# EAGLE design IN-12Relay (EAGLE 9.5.2)
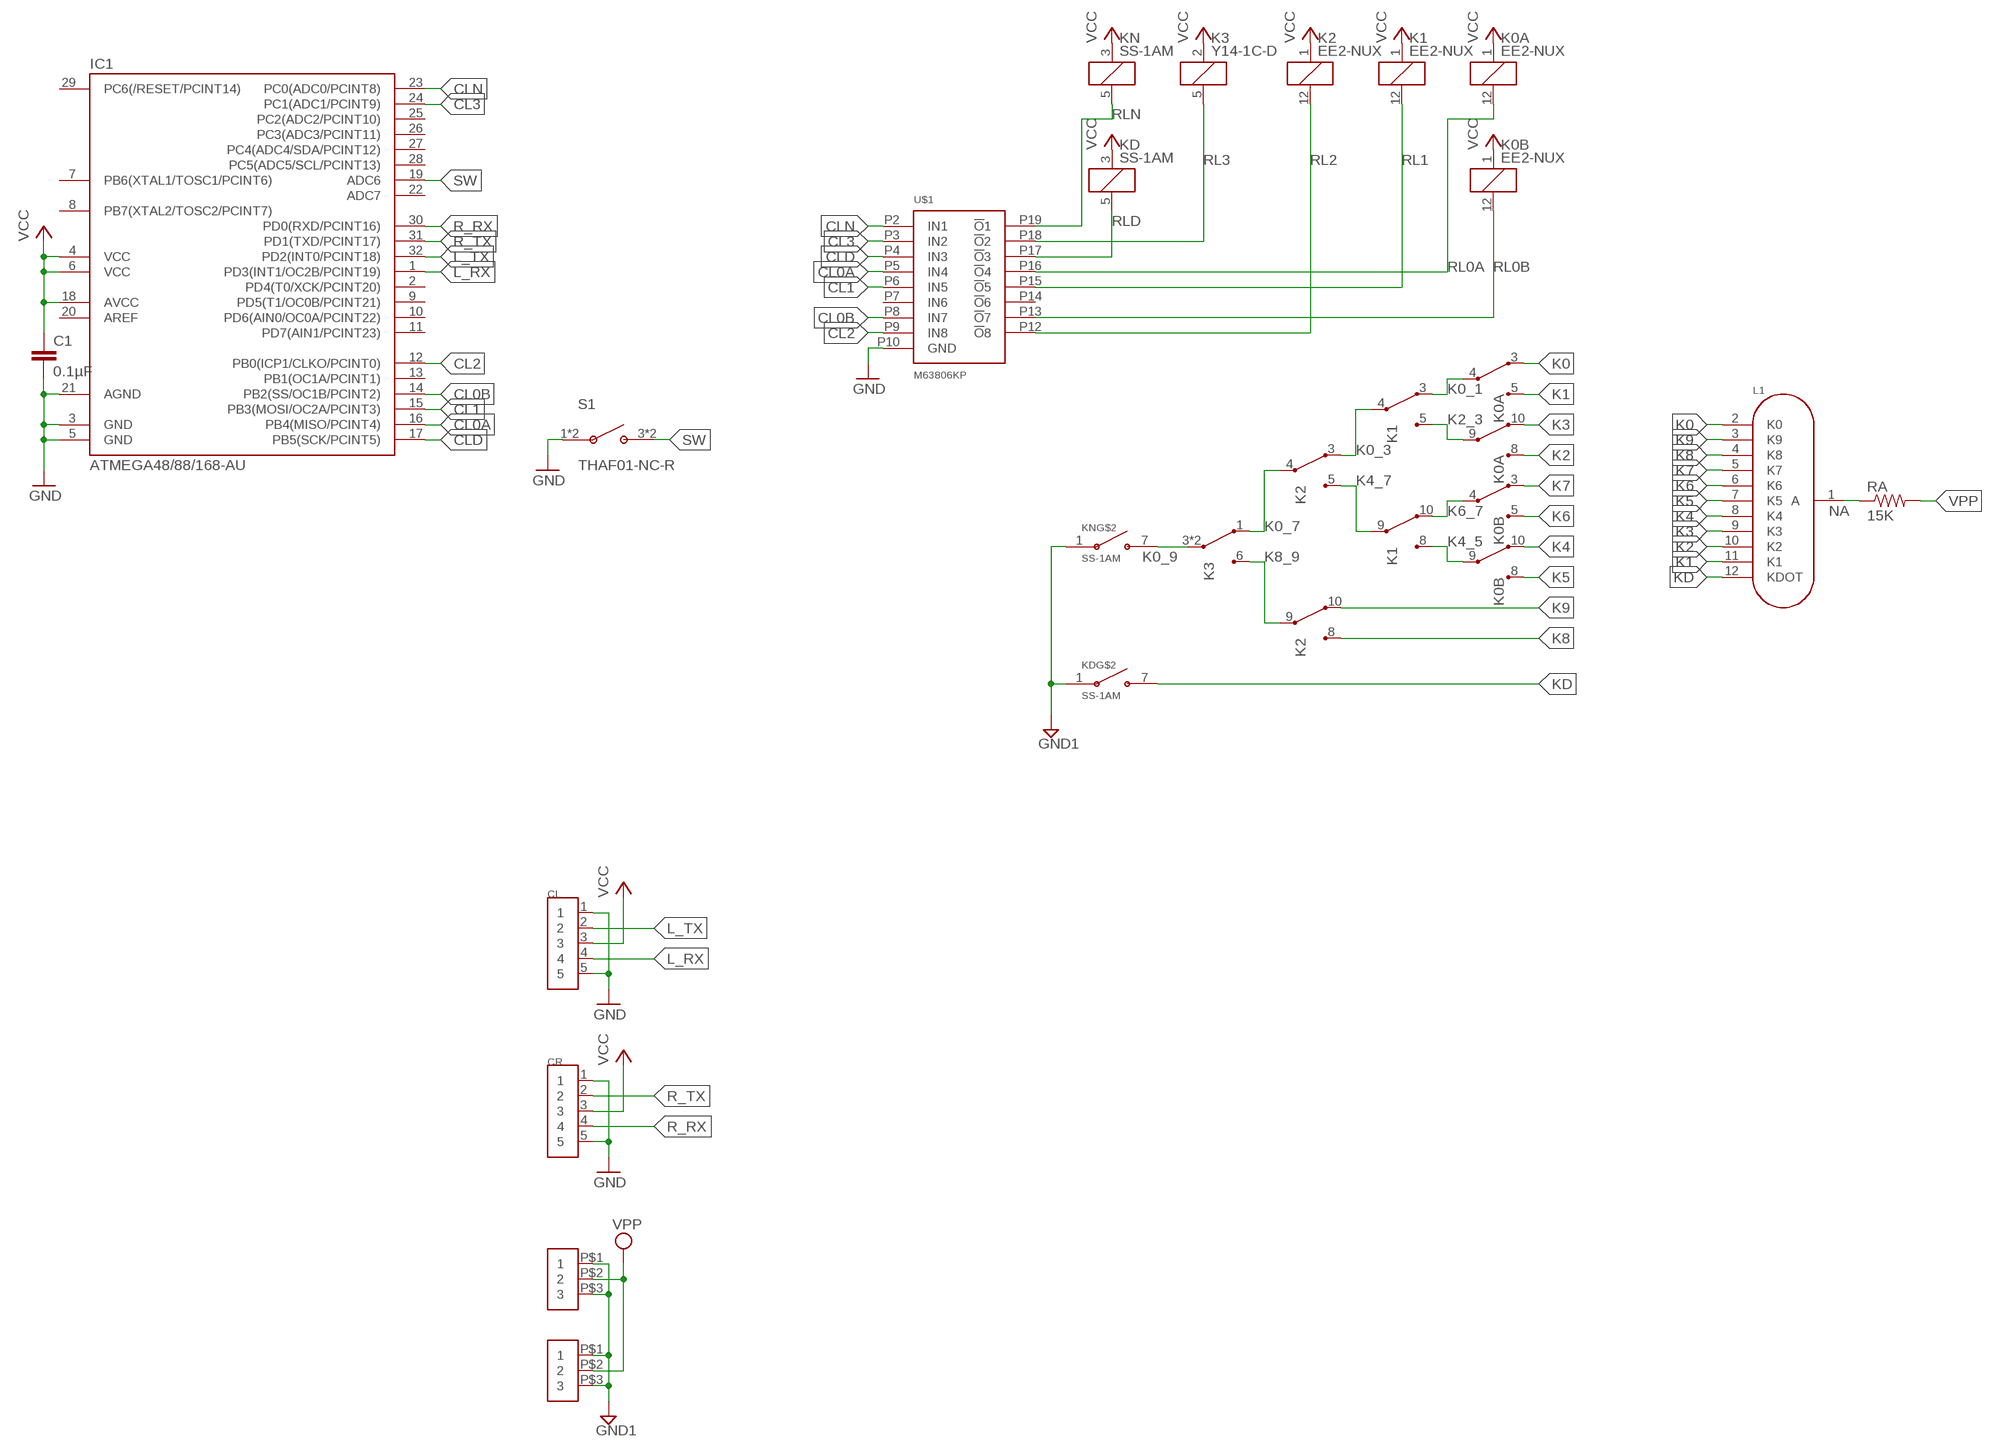
[diagram p0: schematic, sheet 1]

## Parts
C1  0.1µF  C-EUC0603K  [C0603K]
CL  P5  [P5_2.54]
CR  P5  [P5_2.54]
IC1  ATMEGA48/88/168-AU  [TQFP32-08]
K0A  EE2-NUX  [EE2-*NUX]
K0B  EE2-NUX  [EE2-*NUX]
K1  EE2-NUX  [EE2-*NUX]
K2  EE2-NUX  [EE2-*NUX]
K3  Y14-1C-D  [Y14*-1C-*D*]
KD  SS-1AM  [SS-1****M]
KN  SS-1AM  [SS-1****M]
L1  IN-12B_PS  [IN-12_PS]
PL  P3  [P3_2.54]
PR  P3  [P3_2.54]
RA  15K  R-US_R1206  [R1206]
S1  THAF01-NC-R  [THAF01-NC-R]
U$1  M63806KP  [20P2E]

## Nets
CL0A: IC1.16(PB4(MISO/PCINT4)) U$1.P5(IN4)
CL0B: IC1.14(PB2(SS/OC1B/PCINT2)) U$1.P8(IN7)
CL1: IC1.15(PB3(MOSI/OC2A/PCINT3)) U$1.P6(IN5)
CL2: IC1.12(PB0(ICP1/CLKO/PCINT0)) U$1.P9(IN8)
CL3: IC1.24(PC1(ADC1/PCINT9)) U$1.P3(IN2)
CLD: IC1.17(PB5(SCK/PCINT5)) U$1.P4(IN3)
CLN: IC1.23(PC0(ADC0/PCINT8)) U$1.P2(IN1)
GND: C1.2 CL.1 CL.5 CR.1 CR.5 IC1.3(GND) IC1.5(GND) IC1.21(AGND) S1.1(A) S1.2(A) U$1.P10(GND)
GND1: KD.1 KN.1 PL.P$1 PL.P$3 PR.P$1 PR.P$3
K0: K0A.3(S) L1.2(K0)
K0_1: K0A.4(P) K1.3(S)
K0_3: K1.4(P) K2.3(S)
K0_7: K2.4(P) K3.1(S)
K0_9: K3.3(P) K3.4(P) KN.7
K1: K0A.5(O) L1.11(K1)
K2: K0A.8(O) L1.10(K2)
K2_3: K0A.9(P) K1.5(O)
K3: K0A.10(S) L1.9(K3)
K4: K0B.10(S) L1.8(K4)
K4_5: K0B.9(P) K1.8(O)
K4_7: K1.9(P) K2.5(O)
K5: K0B.8(O) L1.7(K5)
K6: K0B.5(O) L1.6(K6)
K6_7: K0B.4(P) K1.10(S)
K7: K0B.3(S) L1.5(K7)
K8: K2.8(O) L1.4(K8)
K8_9: K2.9(P) K3.6(O)
K9: K2.10(S) L1.3(K9)
KD: KD.7 L1.12(KDOT)
L_RX: CL.4 IC1.1(PD3(INT1/OC2B/PCINT19))
L_TX: CL.2 IC1.32(PD2(INT0/PCINT18))
NA: L1.1(A) RA.1
R_RX: CR.4 IC1.30(PD0(RXD/PCINT16))
R_TX: CR.2 IC1.31(PD1(TXD/PCINT17))
RL0A: K0A.12 U$1.P16(!O!4)
RL0B: K0B.12 U$1.P13(!O!7)
RL1: K1.12 U$1.P15(!O!5)
RL2: K2.12 U$1.P12(!O!8)
RL3: K3.5 U$1.P18(!O!2)
RLD: KD.5 U$1.P17(!O!3)
RLN: KN.5 U$1.P19(!O!1)
SW: IC1.19(ADC6) S1.3(B) S1.4(B)
VCC: C1.1 CL.3 CR.3 IC1.4(VCC) IC1.6(VCC) IC1.18(AVCC) K0A.1 K0B.1 K1.1 K2.1 K3.2 KD.3 KN.3
VPP: PL.P$2 PR.P$2 RA.2
Unconnected: IC1.2(PD4(T0/XCK/PCINT20)) IC1.7(PB6(XTAL1/TOSC1/PCINT6)) IC1.8(PB7(XTAL2/TOSC2/PCINT7)) IC1.9(PD5(T1/OC0B/PCINT21)) IC1.10(PD6(AIN0/OC0A/PCINT22)) IC1.11(PD7(AIN1/PCINT23)) IC1.13(PB1(OC1A/PCINT1)) IC1.20(AREF) IC1.22(ADC7) IC1.25(PC2(ADC2/PCINT10)) IC1.26(PC3(ADC3/PCINT11)) IC1.27(PC4(ADC4/SDA/PCINT12)) IC1.28(PC5(ADC5/SCL/PCINT13)) IC1.29(PC6(/RESET/PCINT14)) U$1.P7(IN6) U$1.P14(!O!6)

## Library data of the parts
C1 = rcl:C-EU: CAPACITOR, European symbol; SPICEPREFIX: C
CL CR = pins:P5
IC1 = atmega8:ATMEGA48/88/168
K0A K0B K1 K2 = relays:EE2-*NUX
K3 = relays:Y14*-1C-*D*
KD KN = relays:SS-1A**M
L1 = nixie-tube:IN-12B_PS
PL PR = pins:P3
RA = rcl:R-US_: RESISTOR, American symbol; SPICEPREFIX: R
S1 = switches:THAF01-NC-R
U$1 = transistor-arrays:M63806KP

## Board
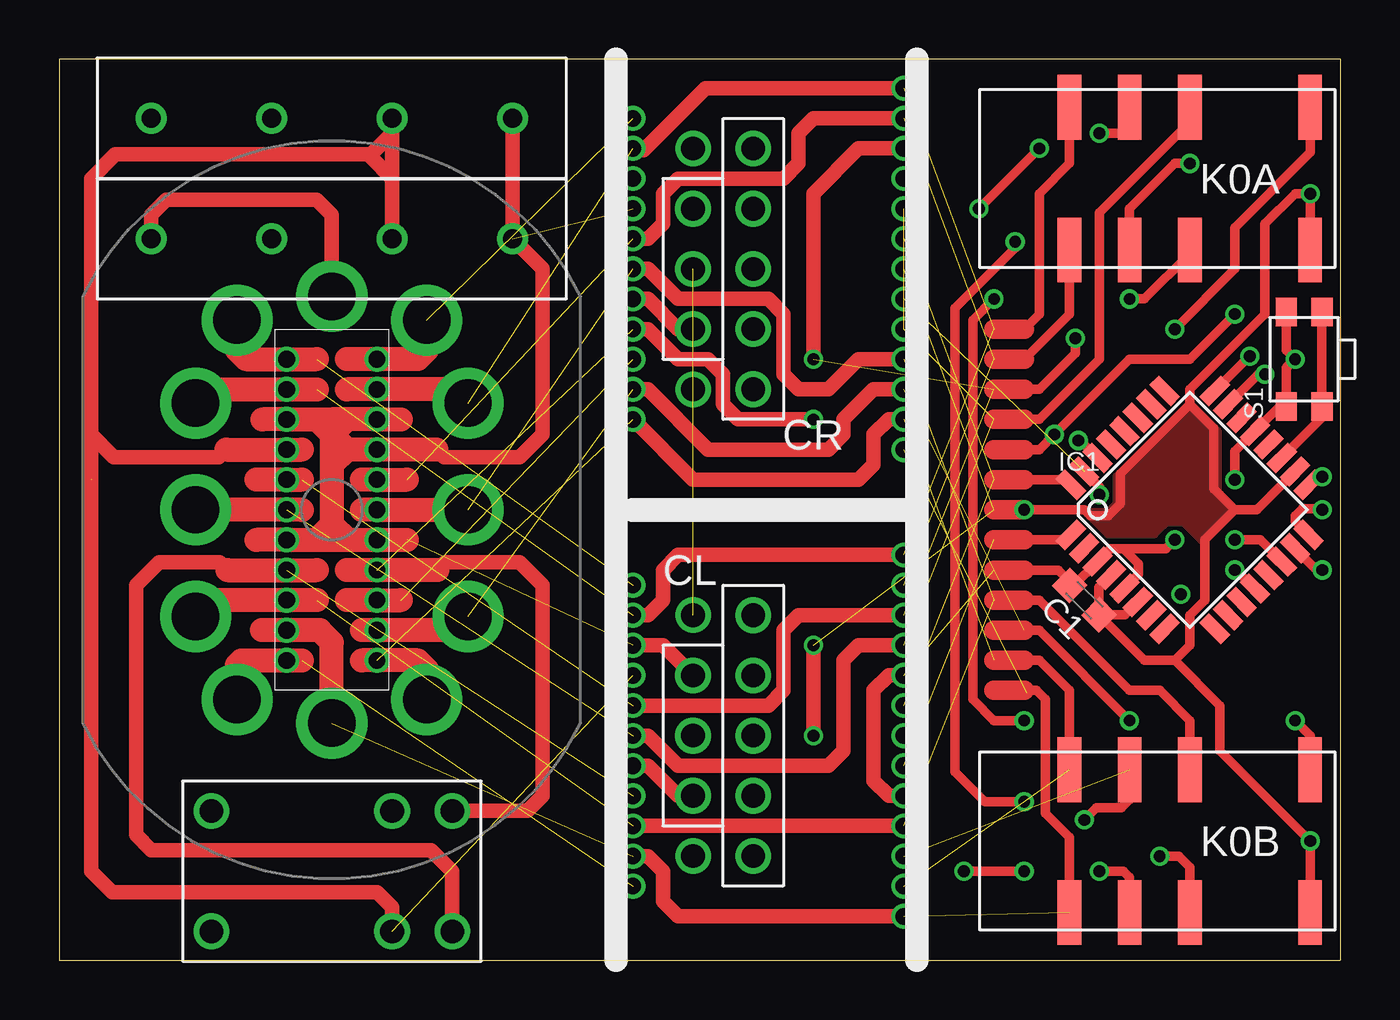
[diagram p1: board, top side]
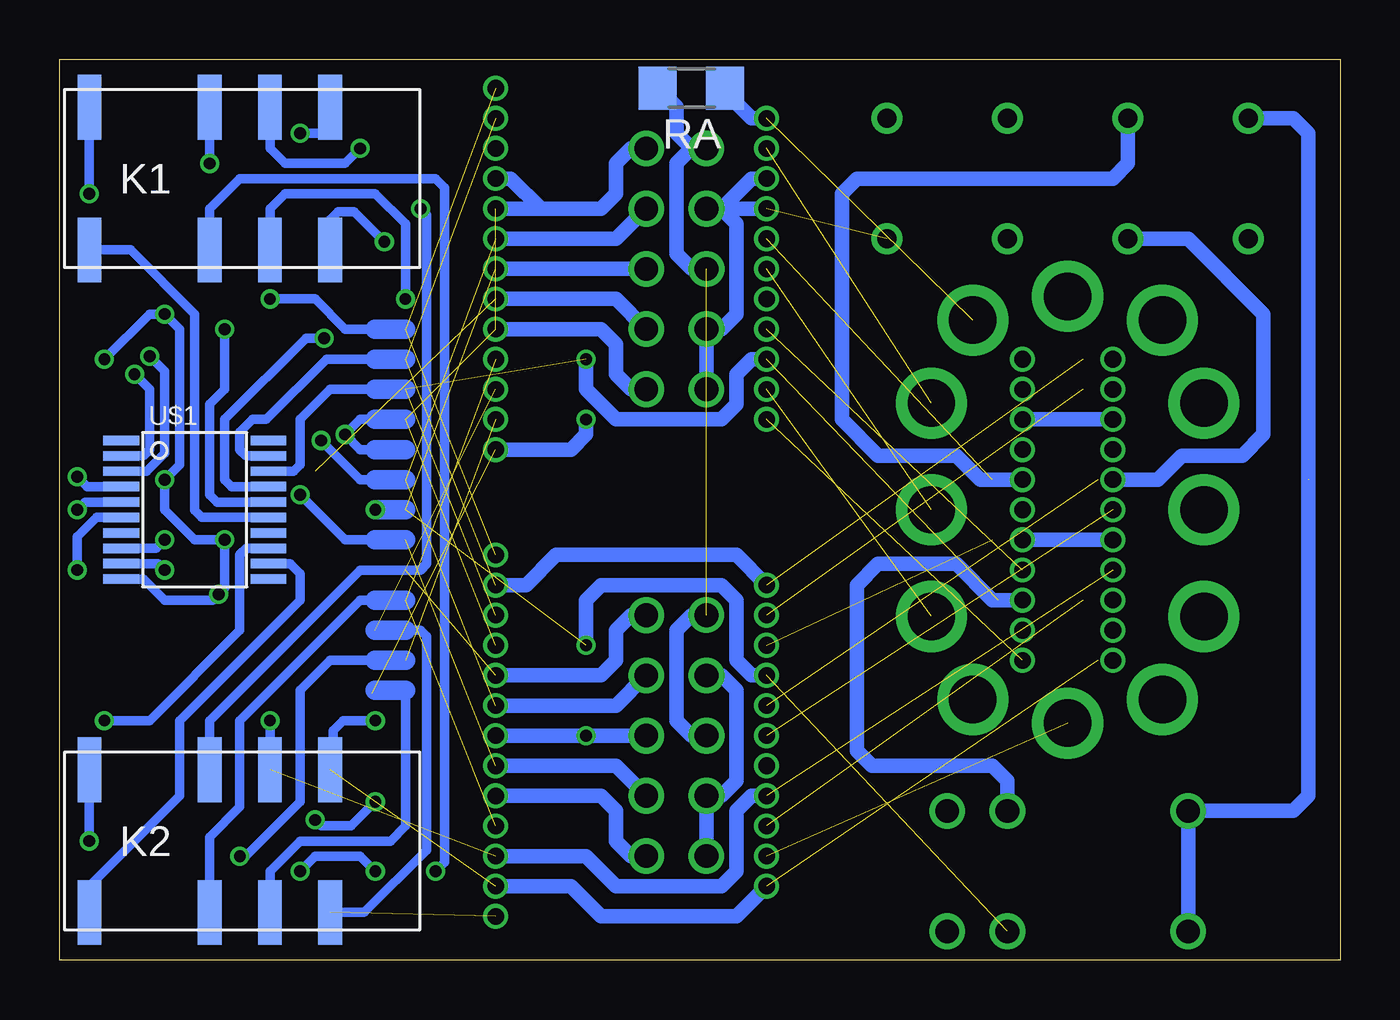
[diagram p2: board, bottom side, seen from below]

Size 54.05 x 38 mm. Coordinates in mm from the lower left corner, seen from the top.
Outline: 0,0 54.05,0 54.05,38 0,38 0,0
Copper layers (1*16): Top 0.035mm / dielectric 1.5mm / Bottom 0.035mm
Design rules "SeeedStudio_2layer_DRU_no_angle_20140221": minimum track width 6mil, minimum drill 12mil, track to track 6mil, track to pad 6mil, pad to pad 6mil, via to via 6mil, smd to smd 0mil, copper to edge 10mil, drill to drill 10mil, minimum pad ring 10mil, minimum via ring 6mil, stop-mask expansion 2mil, vias tented up to drill 100mil, thermal gap 10mil

### Footprints (pad centres in the part's own frame; a part is rotated, then mirrored left to right if it is on the bottom)
C0603K = smd 1.05 x 1.08: 1 -0.875,0; 2 0.875,0
P5_2.54 = drill 1: 1 0,5.08; 2 0,2.54; 3 0,0; 4 0,-2.54; 5 0,-5.08
TQFP32-08 = smd 1.27 x 0.559: 1 -4.293,2.8; 2 -4.293,2; 3 -4.293,1.2; 4 -4.293,0.4; 5 -4.293,-0.4; 6 -4.293,-1.2; 7 -4.293,-2; 8 -4.293,-2.8; 17 4.293,-2.8; 18 4.293,-2; 19 4.293,-1.2; 20 4.293,-0.4; 21 4.293,0.4; 22 4.293,1.2; 23 4.293,2; 24 4.293,2.8 | smd 0.559 x 1.27: 9 -2.8,-4.293; 10 -2,-4.293; 11 -1.2,-4.293; 12 -0.4,-4.293; 13 0.4,-4.293; 14 1.2,-4.293; 15 2,-4.293; 16 2.8,-4.293; 25 2.8,4.293; 26 2,4.293; 27 1.2,4.293; 28 0.4,4.293; 29 -0.4,4.293; 30 -1.2,4.293; 31 -2,4.293; 32 -2.8,4.293
EE2-*NUX = smd 1 x 2.73: 1 -6.35,3.01; 3 -1.27,3.01; 4 1.27,3.01; 5 3.81,3.01; 8 3.81,-3.01; 9 1.27,-3.01; 10 -1.27,-3.01; 12 -6.35,-3.01
Y14*-1C-*D* = drill 1: 1 -5.08,2.54; 2 -2.54,2.54; 3 5.08,2.54; 4 5.08,-2.54; 5 -2.54,-2.54; 6 -5.08,-2.54
SS-1****M = drill 0.8: 1 -7.62,0; 3 -2.54,0; 5 2.54,0; 7 7.62,0
IN-12_PS = drill 2: 1 4,8; 2 5.75,4.5; 3 5.75,0; 4 5.75,-4.5; 5 4,-8; 6 0,-9; 7 -4,-8; 8 -5.75,-4.5; 9 -5.75,0; 10 -5.75,4.5; 11 -4,8; 12 0,9
P3_2.54 = drill 1: P$1 0,2.54; P$2 0,0; P$3 0,-2.54
R1206 = smd 1.6 x 1.803: 1 -1.422,0; 2 1.422,0
THAF01-NC-R = smd 1.2 x 0.9: 1 -2,0.75; 2 2,0.75; 3 -2,-0.75; 4 2,-0.75
20P2E = smd 1.5 x 0.4: P1 -3.1,2.925; P2 -3.1,2.275; P3 -3.1,1.625; P4 -3.1,0.975; P5 -3.1,0.325; P6 -3.1,-0.325; P7 -3.1,-0.975; P8 -3.1,-1.625; P9 -3.1,-2.275; P10 -3.1,-2.925; P11 3.1,-2.925; P12 3.1,-2.275; P13 3.1,-1.625; P14 3.1,-0.975; P15 3.1,-0.325; P16 3.1,0.325; P17 3.1,0.975; P18 3.1,1.625; P19 3.1,2.275; P20 3.1,2.925

### Placement (x,y rotation side)
C1  43.25,15.19 135 top
CL  29.28,9.47 0 top
CR  29.28,29.16 180 top
IC1  47.7,19 45 top
K0A  46.42,32.97 180 top
K0B  46.42,5.03 180 top
K1  46.42,32.97 0 bottom
K2  46.42,5.03 0 bottom
K3  Y14-1C-*D*  [Y14*-1C-*D*]  11.5,3.76 180 top
KD  SS-1A*M  [SS-1****M]  11.5,30.43 180 top
KN  SS-1A*M  [SS-1****M]  11.5,35.51 180 top
L1  11.5,19 0 top
PL  26.74,29.16 0 top
PR  26.74,9.47 0 top
RA  27.38,36.78 180 bottom
S1  52.52,25.35 90 top
U$1  48.33,19 0 bottom

### Tracks (layer width: path | path; a pad name or v marks a point on that pad's centre or on a via)
CL0A  (via drill 0.5)
  Top 0.406: IC1.16 52.14,18.52 52.14,18.75 52.45,19.05 53.23,19.05 v53.28,19
  Bottom 0.406: U$1.P5 52.96,19.32 v53.28,19
CL0B  (via drill 0.5)
  Top 0.406: IC1.14 50.66,17.73 v49.6,17.73
  Bottom 0.406: U$1.P8 49.95,17.38 v49.6,17.73
CL1  (via drill 0.5)
  Top 0.406: IC1.15 53.06,16.46 v53.28,16.46
  Bottom 0.406: U$1.P6 52.47,18.68 53.28,17.86 v53.28,16.46
CL2  (via drill 0.5)
  Top 0.406: v49.6,16.46 49.67,16.46 IC1.12
  Bottom 0.406: U$1.P9 49.87,16.73 v49.6,16.46
CL3  (via drill 0.5)
  Top 0.406: IC1.24 50.21,25.48 v50.23,25.48
  Bottom 0.406: U$1.P3 50.36,20.62 49.6,21.38 49.6,24.84 v50.23,25.48
CLD  (via drill 0.5)
  Top 0.406: IC1.17 53.05,20.4 v53.28,20.4
  Bottom 0.406: v53.28,20.4 52.86,19.98 U$1.P4
CLN  (via drill 0.5)
  Top 0.406: v50.87,24.71 50.58,24.71 IC1.23
  Bottom 0.406: U$1.P2 50.5,21.27 50.23,21.54 50.23,24.08 v50.87,24.71
GND  (via drill 0.5, 0.7)  (3 unrouted)
  Top 0.406: 40.71,21.54 41.34,21.54 v41.98,22.18 45.16,25.35 47.7,25.35 v49.6,27.26 | 51.68,27.26 S1.2 51.77,25.72 v52.14,25.35 51.77,24.98 S1.1 51.48,23.35 IC1.21 49.6,21.47 v49.6,20.27 | 42.81,15.81 IC1.3 44.35,17.35 44.9,17.35 | 42.81,15.81 C1.2 | 40.71,16.46 42.16,16.46 42.81,15.81 | 44.9,17.35 45.54,16.71 45.54,16.27 IC1.5 | 44.9,17.35 46.68,17.35 v47.06,17.73
  Top 0.61: v35.63,6.94 35,6.94 34.36,7.57 34.36,11.38 35,12.02 v35.63,12.02
  Top 0.813: 39.44,16.46 40.71,16.46 | 39.44,21.54 40.71,21.54
  Bottom 0.406: 40.71,21.54 41.34,21.54 v41.98,22.18 41.34,22.81 40.71,22.81 | U$1.P10 50.48,16.07 49.6,15.19 47.57,15.19 v47.31,15.44 47.06,15.7 v47.06,17.73 48.33,17.73 49.6,19 v49.6,20.27 48.97,20.91 48.97,26.62 v49.6,27.26 50.23,27.26 v52.14,25.35
  Bottom 0.61: v35.63,12.02 31.18,12.02 30.55,12.65 30.55,13.92 29.91,14.55 CL.1 | CL.5 29.91,4.39 30.55,5.03 30.55,6.3 31.18,6.94 v35.63,6.94 | 33.73,31.7 31.18,31.7 30.55,32.34 30.55,33.61 29.91,34.24 CR.5 | 33.73,31.7 v35.63,31.7 | v35.63,26.62 31.18,26.62 30.55,25.98 30.55,24.71 29.91,24.08 CR.1 | v35.63,32.97 35,32.97 33.73,31.7
  Bottom 0.813: 40.71,21.54 39.44,21.54 | 40.71,22.81 39.44,22.81
GND1  (via drill 0.7, 1)  (2 unrouted)
  Top 0.61: 15.9,21.54 16.23,21.21 19.43,21.21 20.39,22.18 20.39,29.16 KD.1 KN.1 | v24.2,13.29 25.47,13.29 PR.P$1 | v24.2,8.21 24.84,8.21 26.11,6.94 PR.P$3 | v24.2,27.89 24.84,27.89 26.11,26.62 PL.P$3
  Top 1.016: 15.9,21.54 v13.4,21.54 12.13,21.54 | 10.87,17.73 v9.6,17.73 8.32,17.73 | 10.87,17.73 11.5,17.73 | 11.5,17.73 12.13,17.73 | 12.13,17.73 v13.4,17.73 14.68,17.73 | 10.87,22.81 v9.6,22.81 8.58,22.81 | 10.87,22.81 11.5,22.81 | 12.13,22.81 v13.4,22.81 14.42,22.81 | 12.13,22.81 11.5,22.81 | 11.5,21.54 11.5,20.91 | 11.5,20.91 11.5,18.36 | 11.5,18.36 11.5,17.73 | 12.13,21.54 11.5,21.54 | 10.87,17.73 11.5,18.36 | 11.5,18.36 12.13,17.73 | 11.5,22.81 11.5,22.18 | 11.5,22.18 11.5,21.54 | 10.87,22.81 11.5,22.18 | 12.13,21.54 11.5,22.18 | 11.5,22.18 12.13,22.81 | 11.5,20.91 12.13,21.54
  Bottom 0.61: PR.P$1 26.11,12.02 25.47,11.38 25.47,7.57 26.11,6.94 PR.P$3 v26.74,4.39 | v26.74,24.08 PL.P$3 26.11,26.62 25.47,27.26 25.47,31.06 26.11,31.7 | 26.11,31.7 PL.P$1 | v24.2,31.7 26.11,31.7 | v24.2,32.97 24.84,32.97 26.11,31.7 | v9.6,17.73 v13.4,17.73 | v9.6,22.81 v13.4,22.81
K0  (via drill 0.5, 0.7)  (2 unrouted)
  Top 0.406: 47.7,29.8 45.79,27.89 v45.16,27.89
  Top 0.61: v24.2,34.24 24.27,34.17 24.65,34.17 27.26,36.78 v35.63,36.78
  Top 0.813: K0A.3 47.7,29.8
  Top 1.016: L1.2 17.16,23.5 16.58,24.08 v13.4,24.08 12.13,24.08
  Bottom 0.406: v45.16,27.89 43.25,27.89 41.98,26.62 40.71,26.62
  Bottom 0.813: 40.71,26.62 39.44,26.62
K0_1  (via drill 0.5)
  Top 0.406: v47.7,33.61 47.06,33.61 45.16,31.7 K0A.4
  Bottom 0.406: K1.3 v47.7,33.61
K0_3  (via drill 0.5)
  Top 0.406: v38.8,31.7 v41.34,34.24
  Bottom 0.406: K1.4 45.16,34.24 44.52,33.61 41.98,33.61 v41.34,34.24 | K2.3 47.7,10.11 41.34,16.46 38.8,16.46 38.55,16.71 38.55,31.45 v38.8,31.7
  Bottom 0.813: K2.3 47.7,7.66
K0_7  (via drill 0.5, 0.7)  (2 unrouted)
  Top 0.406: 40.71,13.92 41.34,13.92 v45.16,10.11
  Top 0.61: K3.1 16.58,3.76 15.69,4.65 3.88,4.65 3.24,5.28 3.24,15.82 4.21,16.79 6.77,16.79 7.1,16.46
  Top 0.813: 40.71,13.92 39.44,13.92
  Top 1.016: 7.1,16.46 v9.6,16.46 10.87,16.46
  Bottom 0.406: K2.4 v45.16,10.11
  Bottom 0.61: v24.2,6.94 24.84,6.94 25.47,6.3 25.47,3.76 26.11,3.12 30.55,3.12 31.82,4.39 v35.63,4.39
K0_9
  Bottom 0.61: KN.7 1.97,35.51 1.34,34.88 1.34,6.94 1.97,6.3 K3.4 K3.3
K1  (via drill 0.7)  (2 unrouted)
  Top 0.406: K0A.5 42.61,27.26 40.71,25.35
  Top 0.813: 40.71,25.35 39.44,25.35
  Top 1.016: L1.11 7.5,25.73 7.88,25.35 v9.6,25.35 10.87,25.35
  Bottom 0.61: v24.2,15.82 25.47,17.09 33.09,17.09 34.36,15.82 v35.63,15.82
K2  (via drill 0.7)  (2 unrouted)
  Top 0.406: K0A.8 42.61,33.61 41.34,32.34 41.34,27.26 40.71,26.62
  Top 0.61: v24.2,14.55 24.84,14.55 25.47,15.19 25.47,16.46 26.11,17.09 v35.63,17.09
  Top 0.813: 40.71,26.62 39.44,26.62
  Top 1.016: L1.10 5.84,23.5 6.42,24.08 v9.6,24.08 10.87,24.08
K2_3  (via drill 0.5)
  Top 0.406: v43.88,34.88 45.16,34.88 K0A.9
  Bottom 0.406: K1.5 42.61,34.88 v43.88,34.88
K3  (via drill 0.7)  (2 unrouted)
  Top 0.406: 47.7,35.34 43.88,31.54 43.88,25.35 41.34,22.81 40.71,22.81
  Top 0.61: v35.63,13.29 33.73,13.29 33.09,12.65 33.09,8.84 32.45,8.21 26.11,8.21 24.84,9.47 v24.2,9.47
  Top 0.813: K0A.10 47.7,35.34 | 40.71,22.81 39.44,22.81
  Top 1.016: L1.9 v9.6,19 10.23,19
K4  (via drill 0.7)  (2 unrouted)
  Top 0.406: 40.71,15.19 41.34,15.19 45.16,11.38 46.42,11.38 47.7,10.11 K0B.10
  Top 0.61: v24.2,5.66 v35.63,5.66
  Top 0.813: 40.71,15.19 39.44,15.19
  Top 1.016: 10.87,15.19 v9.6,15.19 6.44,15.19 L1.8
K4_5  (via drill 0.5)
  Top 0.406: K0B.9 45.16,6.77 44.81,6.43 43.76,6.43 v43.25,5.92 | v40.33,30.3 40.33,30.05 37.79,27.51 37.79,7.95 39.06,6.68 v40.71,6.68
  Bottom 0.406: K1.8 42.61,31.23 42.27,31.57 41.6,31.57 v40.33,30.3 | v43.25,5.92 43,5.66 41.73,5.66 v40.71,6.68
K4_7  (via drill 0.5)
  Top 0.406: v40.71,10.11 39.44,10.11 38.55,11 38.55,27 v39.44,27.89
  Bottom 0.406: K2.5 42.49,8.17 42.49,9.69 42.07,10.11 v40.71,10.11 | v39.44,27.89 39.44,31.06 40.71,32.34 44.52,32.34 45.16,31.7 K1.9
K5  (via drill 0.7)  (2 unrouted)
  Top 0.406: K0B.8 42.61,11.38 41.34,12.65 40.71,12.65
  Top 0.813: 40.71,12.65 39.44,12.65
  Top 1.016: L1.7 7.5,12.46 7.69,12.65 v9.6,12.65 10.23,12.65
  Bottom 0.61: v24.2,3.12 25.47,1.86 31.18,1.86 32.45,3.12 v35.63,3.12
K6  (via drill 0.7)  (2 unrouted)
  Top 0.406: K0B.5 42.61,5.2 41.6,6.21 41.6,11 41.22,11.38 40.71,11.38
  Top 0.61: v24.2,4.39 24.84,4.39 25.47,3.76 25.47,2.49 26.11,1.86 v35.63,1.86
  Top 0.813: 39.44,11.38 40.71,11.38
  Top 1.016: 8.54,13.92 v9.6,13.92 10.99,13.92 11.5,13.41 L1.6
K6_7  (via drill 0.5)
  Top 0.406: K0B.4 45.16,3.51 44.9,3.76 v43.88,3.76 | v40.71,3.76 v38.17,3.76
  Bottom 0.406: v40.71,3.76 41.34,4.39 43.25,4.39 v43.88,3.76 | K1.10 47.7,31.7 46.42,32.97 38.17,32.97 37.79,32.59 37.79,4.14 v38.17,3.76
K7  (via drill 0.5, 0.7)  (2 unrouted)
  Top 0.406: K0B.3 47.7,3.93 47.23,4.39 v46.42,4.39
  Top 0.61: v35.63,22.81 35,22.81 34.36,22.18 34.36,20.91 33.73,20.27 26.74,20.27 v24.2,22.81
  Top 1.016: L1.5 15.5,12.27 15.12,12.65 v13.4,12.65 12.77,12.65
  Bottom 0.406: v46.42,4.39 46.17,4.39 43.88,6.68 43.88,11.38 42.61,12.65 40.71,12.65
  Bottom 0.813: 39.44,12.65 40.71,12.65
K8  (via drill 0.7)  (2 unrouted)
  Top 0.61: v24.2,24.08 24.84,24.08 27.38,21.54 32.45,21.54 33.09,22.18 33.09,22.81 34.36,24.08 v35.63,24.08
  Top 1.016: L1.4 16.67,13.92 v13.4,13.92 12.77,13.92
  Bottom 0.406: K2.8 41.18,2.02 38.55,4.65 38.55,13.67 38.8,13.92 39.44,13.92
  Bottom 0.813: 39.44,13.92 40.71,13.92
K8_9  (via drill 0.5, 0.7)  (2 unrouted)
  Top 0.61: K3.6 19.76,6.3 20.39,6.94 20.39,15.82 19.43,16.79 16.27,16.79 15.95,16.46 | v24.2,26.62 24.84,26.62 26.11,25.35 27.38,25.35 28.01,24.71 28.01,23.45 28.64,22.81 v31.82,22.81
  Top 1.016: 15.95,16.46 v13.4,16.46 12.13,16.46
  Bottom 0.406: K2.9 45.16,3.76 43.88,5.03 40.08,5.03 39.44,5.66 39.44,11.38 | 40.71,11.38 40.84,11.25
  Bottom 0.61: v31.82,22.81 31.82,22.18 32.45,21.54 v35.63,21.54
  Bottom 0.813: 39.44,11.38 40.71,11.38
K9  (via drill 0.7)  (2 unrouted)
  Top 0.61: v24.2,29.16 24.84,29.16 26.11,27.89 29.91,27.89 30.55,27.26 30.55,24.71 31.18,24.08 32.45,24.08 33.73,25.35 v35.63,25.35
  Top 1.016: L1.3 v13.4,19 12.77,19
  Bottom 0.406: K2.10 47.7,5.2 46.42,6.46 46.42,10.11 41.34,15.19 40.71,15.19
  Bottom 0.813: 39.44,15.19 40.71,15.19
KD
  Top 0.61: 11.5,27.89 L1.12 11.5,31.45 10.87,32.08 4.51,32.08 3.88,31.45 KD.7
L_RX  (via drill 0.7)  (1 unrouted)
  Top 0.406: IC1.1 42.47,17.73 40.71,17.73
  Top 0.813: 40.71,17.73 39.44,17.73
  Bottom 0.61: CL.4 30.55,8.21 v35.63,8.21
L_TX  (via drill 0.7)  (1 unrouted)
  Top 0.406: IC1.32 42.47,20.27 40.71,20.27
  Top 0.813: 40.71,20.27 39.44,20.27
  Bottom 0.61: CL.2 30.55,10.74 v35.63,10.74
NA  (via drill 0.7)  (1 unrouted)
  Top 1.016: L1.1 15.5,25.73 15.12,25.35 v13.4,25.35 12.13,25.35
  Bottom 0.61: v24.2,35.51 24.84,35.51 25.95,36.63 RA.1
R_RX  (via drill 0.5, 0.7)  (1 unrouted)
  Top 0.406: v43,21.92 43.08,21.92 IC1.30
  Bottom 0.406: v43,21.92 41.34,20.27 40.71,20.27
  Bottom 0.61: CR.4 30.55,30.43 v35.63,30.43
  Bottom 0.813: 40.71,20.27 39.44,20.27
R_TX  (via drill 0.5, 0.7)  (1 unrouted)
  Top 0.406: IC1.31 43.88,19.98 v43.88,19.64
  Bottom 0.406: 40.08,17.73 41.98,17.73 v43.88,19.64
  Bottom 0.61: CR.2 30.55,27.89 v35.63,27.89
  Bottom 0.813: 40.71,17.73 40.08,17.73 39.44,17.73
RL0A  (via drill 0.5)
  Top 0.406: v47.06,26.62 49.6,29.16 49.6,30.9 52.77,34.08 K0A.12
  Bottom 0.406: v47.06,26.62 47.06,24.08 47.7,23.45 47.7,19.64 47.38,19.32 U$1.P16
RL0B  (via drill 0.5)
  Top 0.406: K0B.12 52.77,9.47 v52.14,10.11
  Bottom 0.406: U$1.P13 46.15,17.38 46.42,17.09 46.42,13.92 50.23,10.11 v52.14,10.11
RL1
  Bottom 0.406: K1.12 51.03,29.96 48.33,27.26 48.33,18.97 48.03,18.68 U$1.P15
RL2
  Bottom 0.406: K2.12 52.77,3.12 48.97,6.94 48.97,10.11 43.88,15.19 43.88,16.31 44.3,16.73 U$1.P12
RL3  (via drill 0.5, 0.7)  (2 unrouted)
  Top 0.61: v31.82,25.35 31.82,32.34 33.73,34.24 v35.63,34.24
  Top 1.016: 12.13,15.19 v13.4,15.19 14.42,15.19
  Bottom 0.406: U$1.P18 44.16,20.62 43.88,20.91 43.88,22.81 42.61,24.08 40.71,24.08
  Bottom 0.61: v24.2,25.35 24.84,25.35 25.47,24.71 25.47,23.45 26.11,22.81 30.55,22.81 31.82,24.08 v31.82,25.35 | v13.4,15.19 14.68,15.19 16.2,16.71 19.5,16.71 20.39,15.82 20.39,8.84 19.76,8.21 14.68,8.21 14.04,7.57 K3.5
  Bottom 0.813: 40.71,24.08 39.44,24.08
RLD  (via drill 0.5, 0.7)  (2 unrouted)
  Top 0.406: v42.87,26.24 42.87,25.6 41.34,24.08 40.71,24.08
  Top 0.61: v24.2,10.74 29.91,10.74 30.55,11.38 30.55,13.92 31.18,14.55 v35.63,14.55
  Top 0.813: 40.71,24.08 39.44,24.08
  Top 1.016: 8.32,20.27 v9.6,20.27 10.23,20.27
  Bottom 0.406: v42.87,26.24 43.63,26.24 47.06,22.81 47.06,20.27 46.77,19.98 U$1.P17
  Bottom 0.61: v9.6,20.27 7.69,20.27 6.67,21.29 4.13,21.29 3.24,22.18 3.24,27.26 6.42,30.43 KD.5
RLN  (via drill 0.7)  (2 unrouted)
  Top 0.61: v35.63,35.51 31.82,35.51 31.18,34.88 31.18,33.61 30.55,32.97 26.11,32.97 25.47,32.34 25.47,31.06 24.84,30.43 v24.2,30.43
  Top 1.016: 14.68,20.27 v13.4,20.27 12.77,20.27
  Bottom 0.406: 44.91,21.27 U$1.P19 46.16,21.27 46.42,21.54 46.42,22.27 45.89,22.81 45.31,22.81 42.77,25.35 40.71,25.35
  Bottom 0.61: KN.5 8.96,33.61 9.6,32.97 20.39,32.97 21.02,32.34 21.02,22.81 19.5,21.29 16.2,21.29 15.18,20.27 v13.4,20.27
  Bottom 0.813: 40.71,25.35 39.44,25.35
SW
  Top 0.406: S1.4 S1.3 53.27,22.88 IC1.19
VCC  (via drill 0.5, 0.7)  (4 unrouted)
  Top 0.406: K0A.1 v52.77,32.34 52.14,32.34 50.87,31.06 50.87,27.26 47.7,24.08 47.7,23.45 | K0B.1 v52.77,5.03 48.97,8.84 48.97,10.74 47.06,12.65 | v40.71,19 43.25,19 43.5,18.75 44.27,18.75 44.77,19.25 44.77,20.52 47.7,23.45 | IC1.4 43.87,15.74 C1.1 | IC1.6 44.96,14.57 C1.1 | C1.1 45.79,12.65 47.06,12.65 | 47.06,12.65 47.7,13.29 47.7,14.55 48.33,15.19 48.33,17.73 49.6,19 | 49.6,19 50.52,19 IC1.18 | 49.6,19 48.71,19.89 48.71,22.43 47.7,23.45
  Top 0.61: 7.05,21.54 6.73,21.21 2.3,21.21 1.34,22.18 | K3.2 14.04,2.24 13.4,2.87 2.23,2.87 1.34,3.76 1.34,20.27 | 1.34,22.18 1.34,32.97 2.36,33.99 13.15,33.99 | 1.34,22.18 1.34,20.29 | KN.3 14.04,34.88 | 14.04,34.88 14.04,32.97 | 14.04,32.97 KD.3 | 14.04,34.88 13.15,33.99 | 13.15,33.99 13.15,33.86 14.04,32.97 | v31.82,9.47 v31.82,13.29
  Top 0.813: v40.71,19 39.44,19
  Top 1.016: 7.05,21.54 v9.6,21.54 10.23,21.54
  Bottom 0.406: K1.1 v52.77,32.34 | v52.77,5.03 K2.1
  Bottom 0.61: v24.2,12.02 24.84,12.02 25.47,12.65 25.47,15.19 26.11,15.82 31.18,15.82 31.82,15.19 v31.82,13.29 | CL.3 v31.82,9.47 v35.63,9.47 | CR.3 v35.63,29.16
  Bottom 0.813: v40.71,19 39.44,19
  pour Top: 43.5,18.75 44.27,17.98 46.04,17.98 46.17,17.98 46.55,18.36 46.68,18.49 47.31,18.49 47.44,18.49 48.2,17.73 48.33,17.73 49.6,19 48.97,19.64 48.84,19.76 48.84,21.41 48.84,22.3 47.7,23.45 44.65,20.4 44.65,19.51 44.65,19.25 44.27,18.87 43.38,18.87
VPP  (via drill 1)  (1 unrouted)
  Bottom 0.61: PR.P$2 27.38,9.47 28.01,10.11 28.01,13.92 27.38,14.55 v26.74,14.55 | 27.38,34.24 28.01,33.61 28.01,29.8 27.38,29.16 PL.P$2 | v26.74,34.24 27.38,34.24 | 27.38,34.24 28.01,34.88 28.01,35.99 RA.2